# EAGLE board mic (EAGLE 6.1)
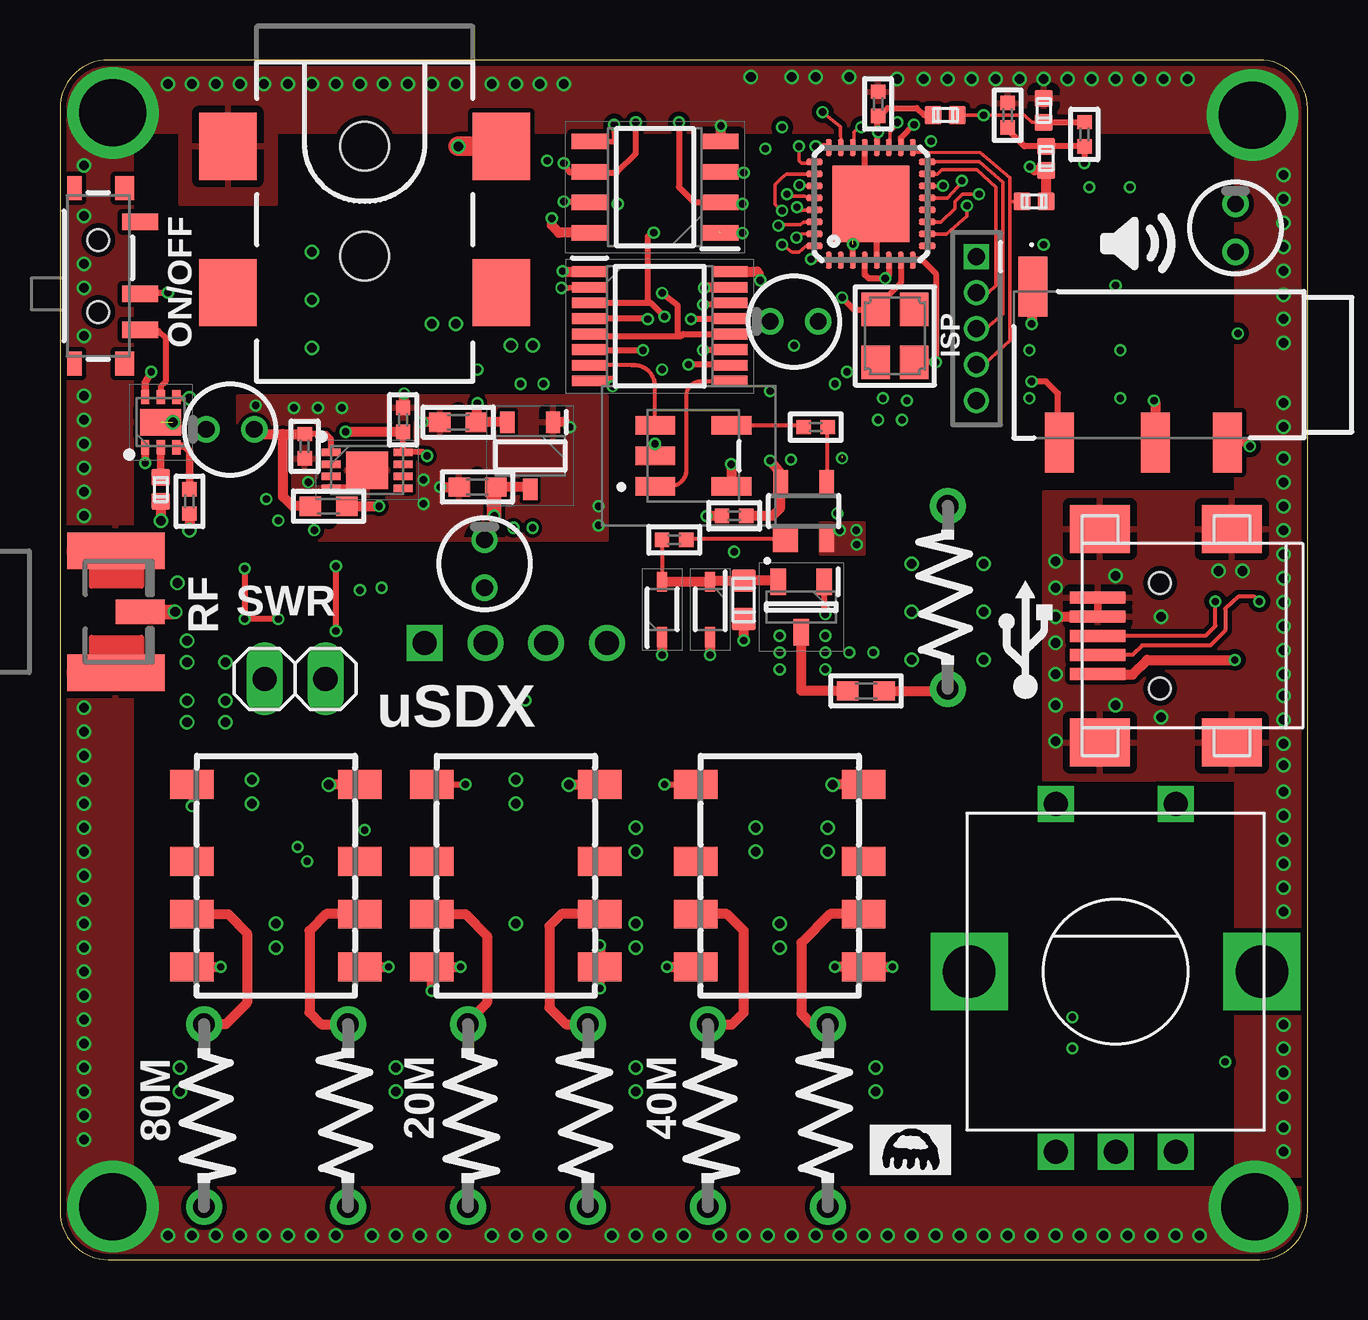
[diagram p3: board, top side]
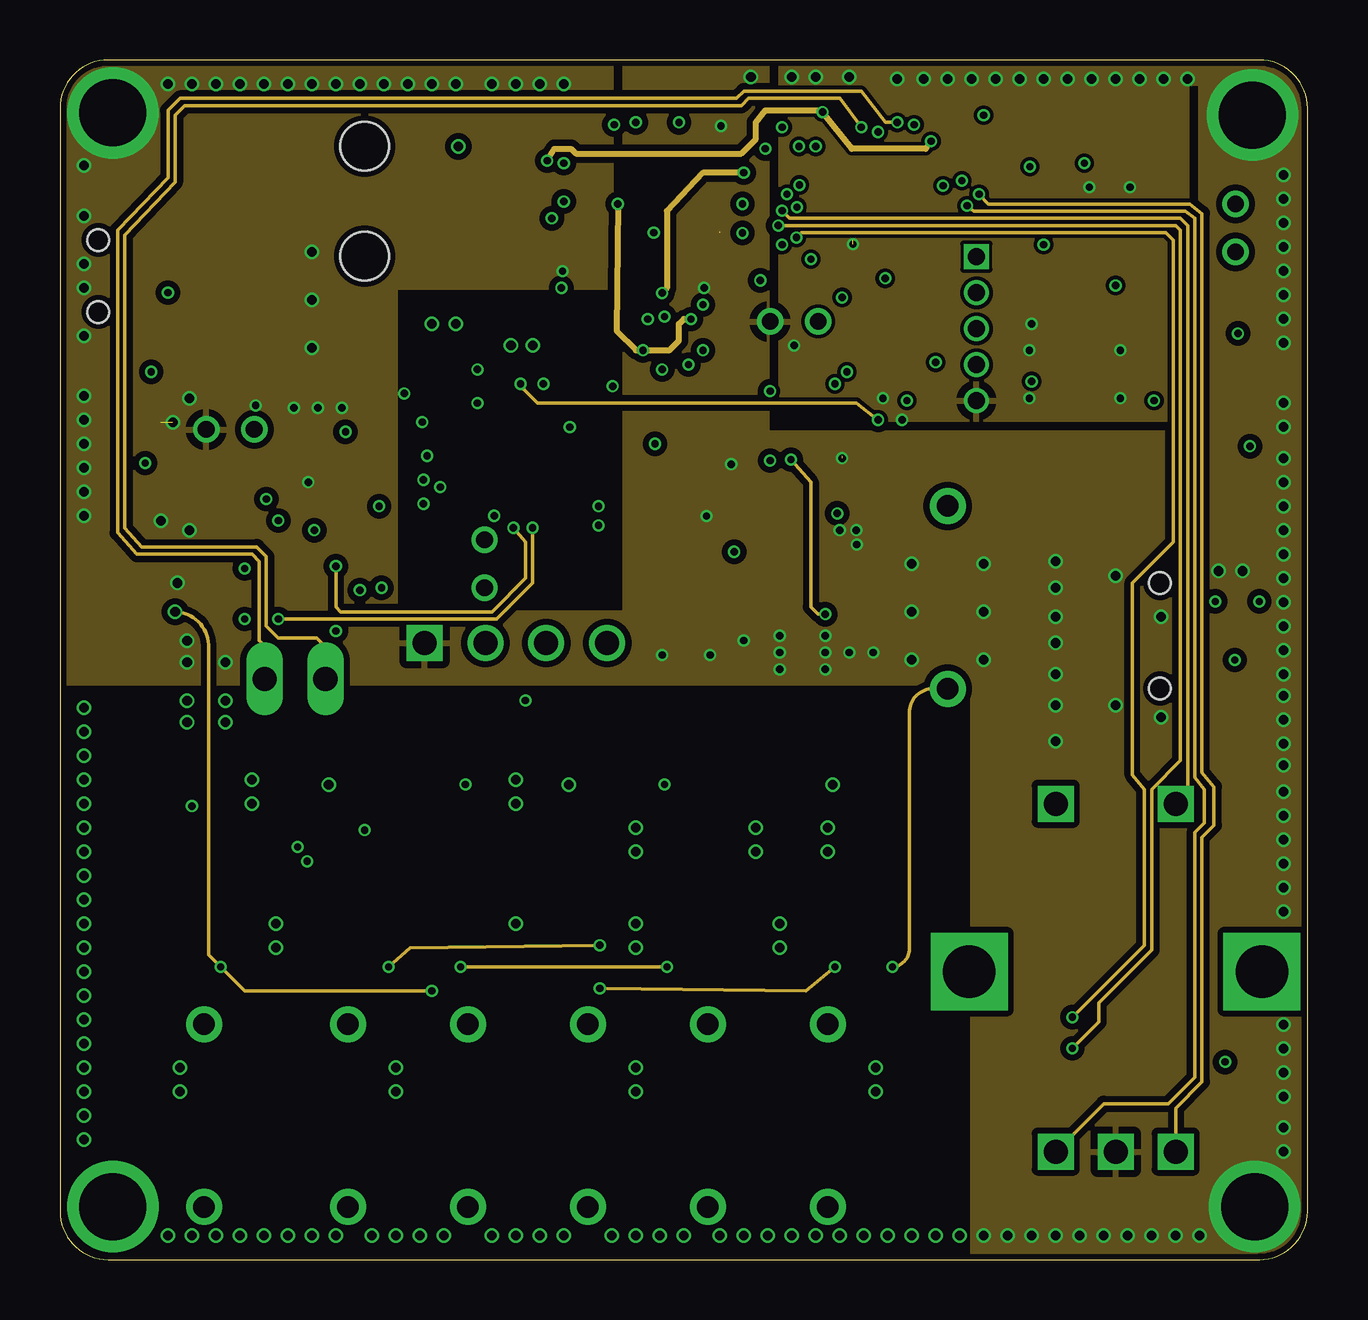
[diagram p4: board, inner layer Route2]
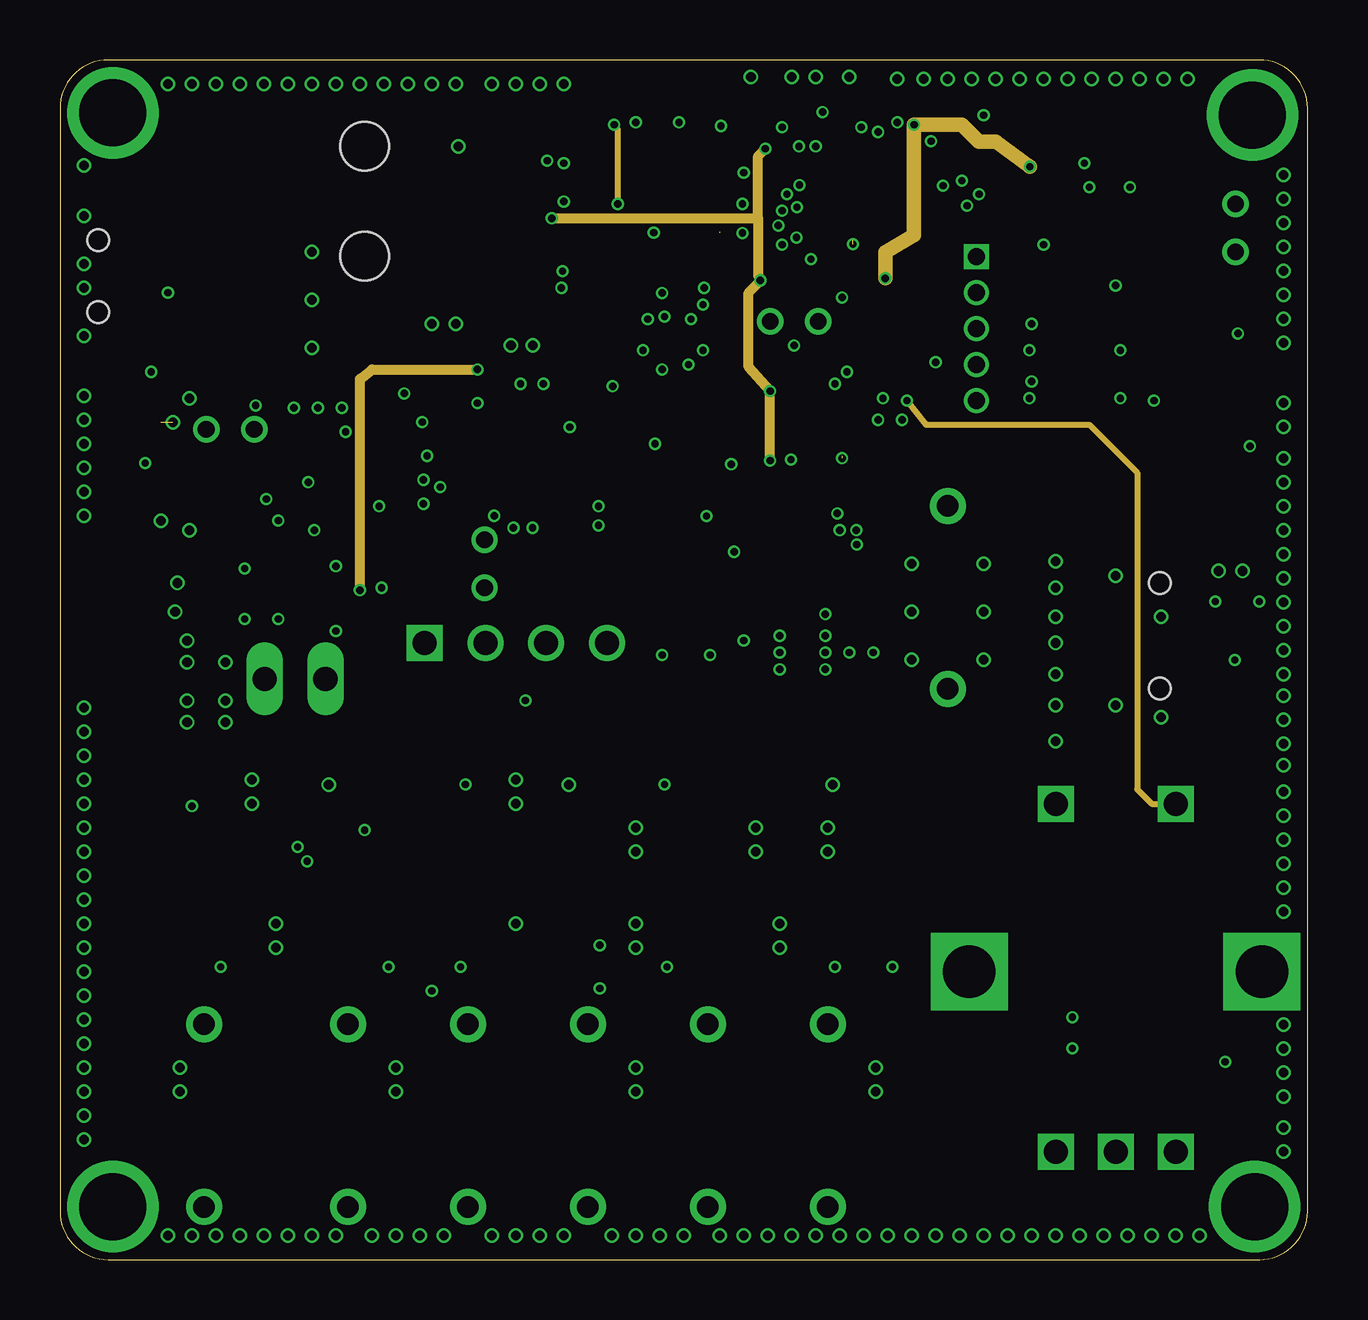
[diagram p5: board, inner layer Route3]
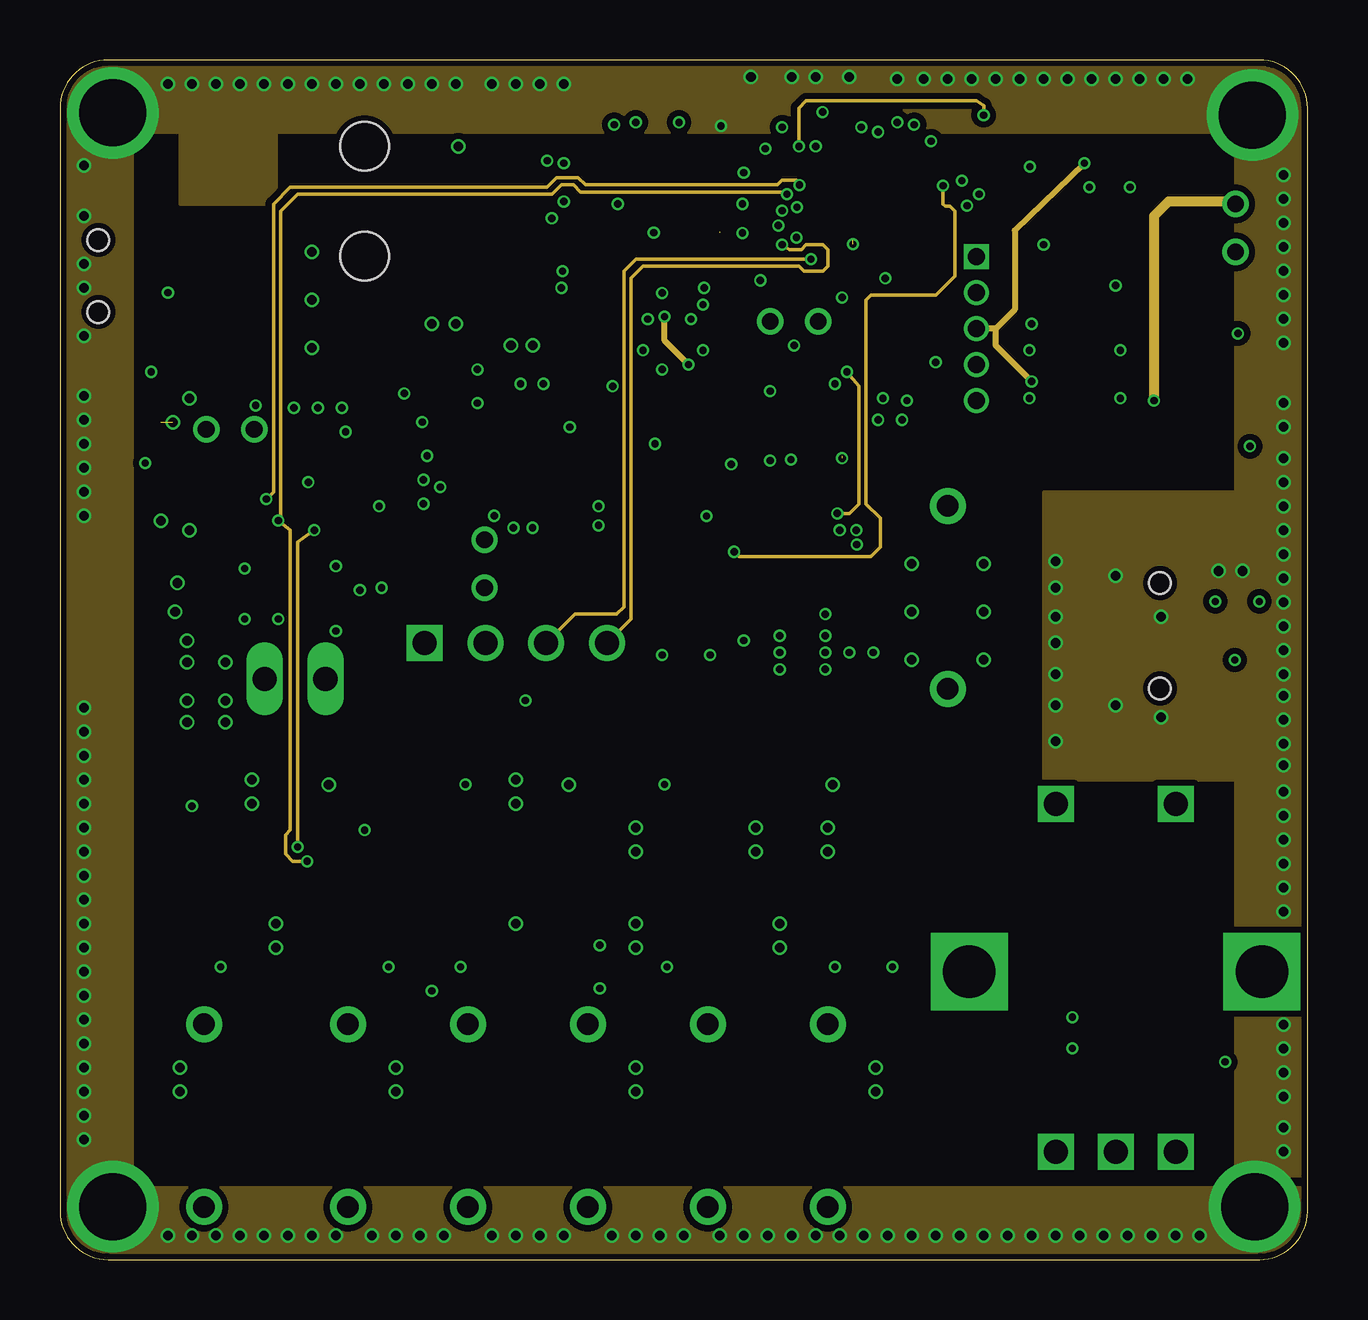
[diagram p6: board, inner layer Route14]
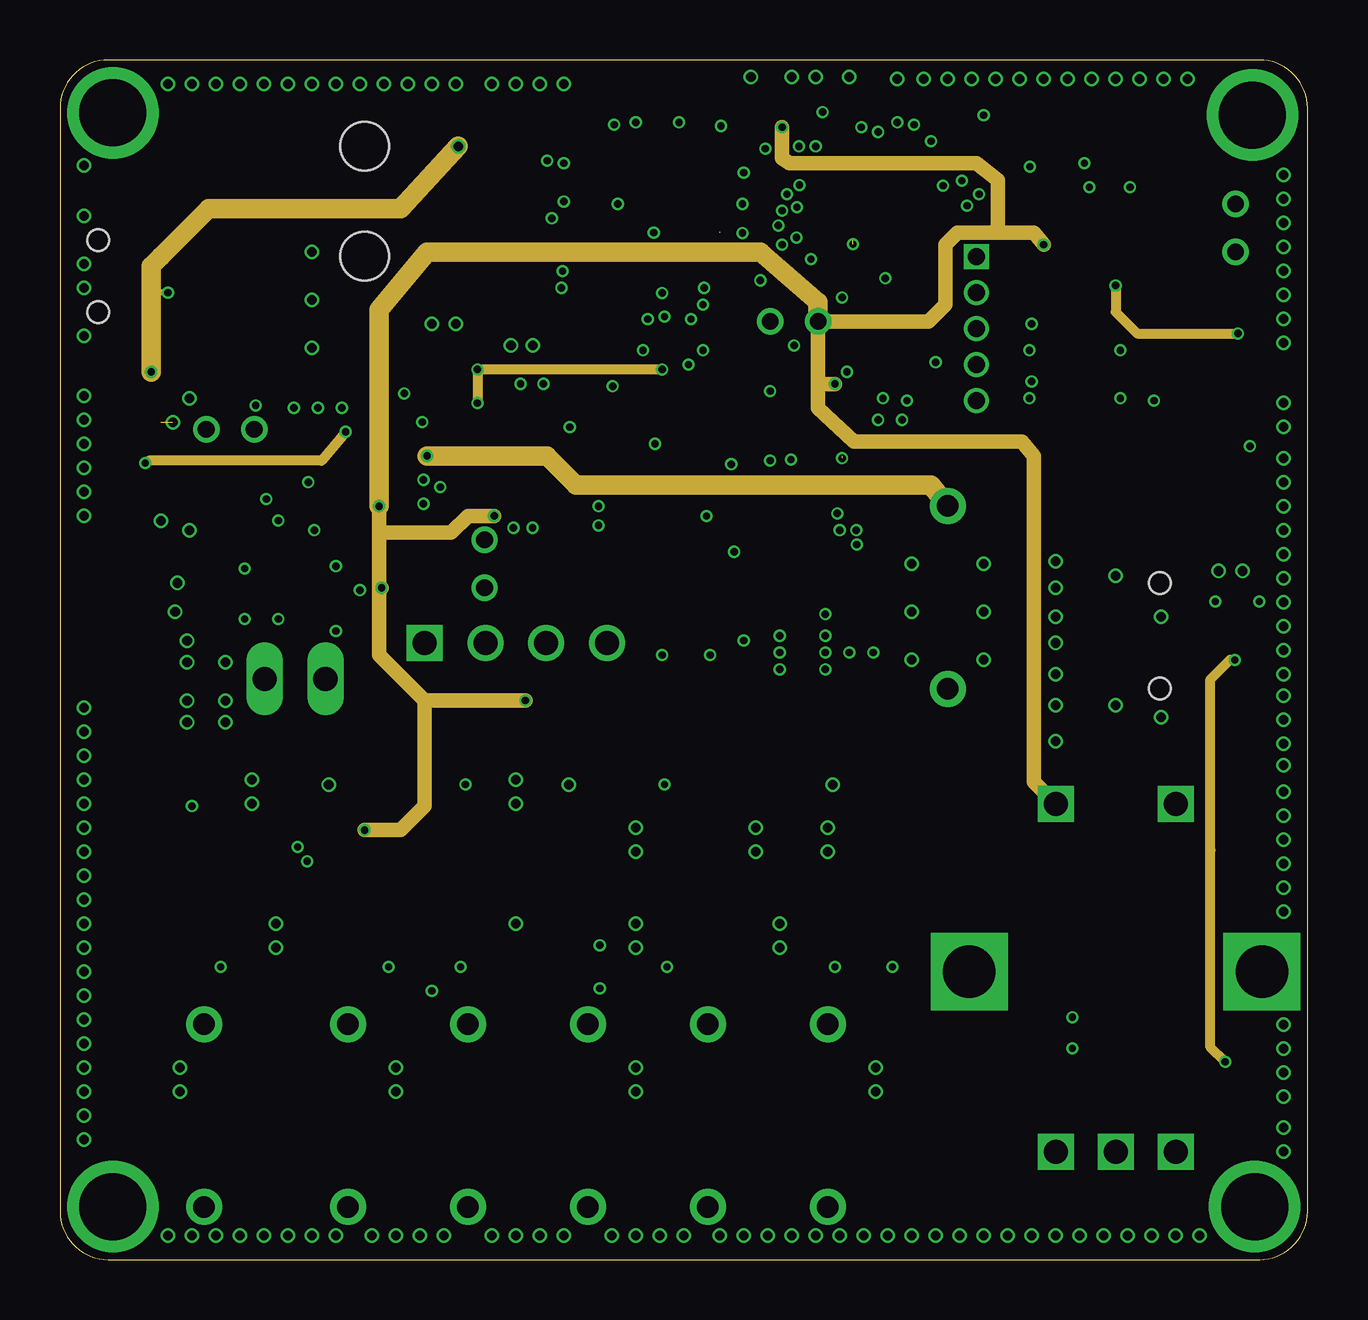
[diagram p7: board, inner layer Route15]
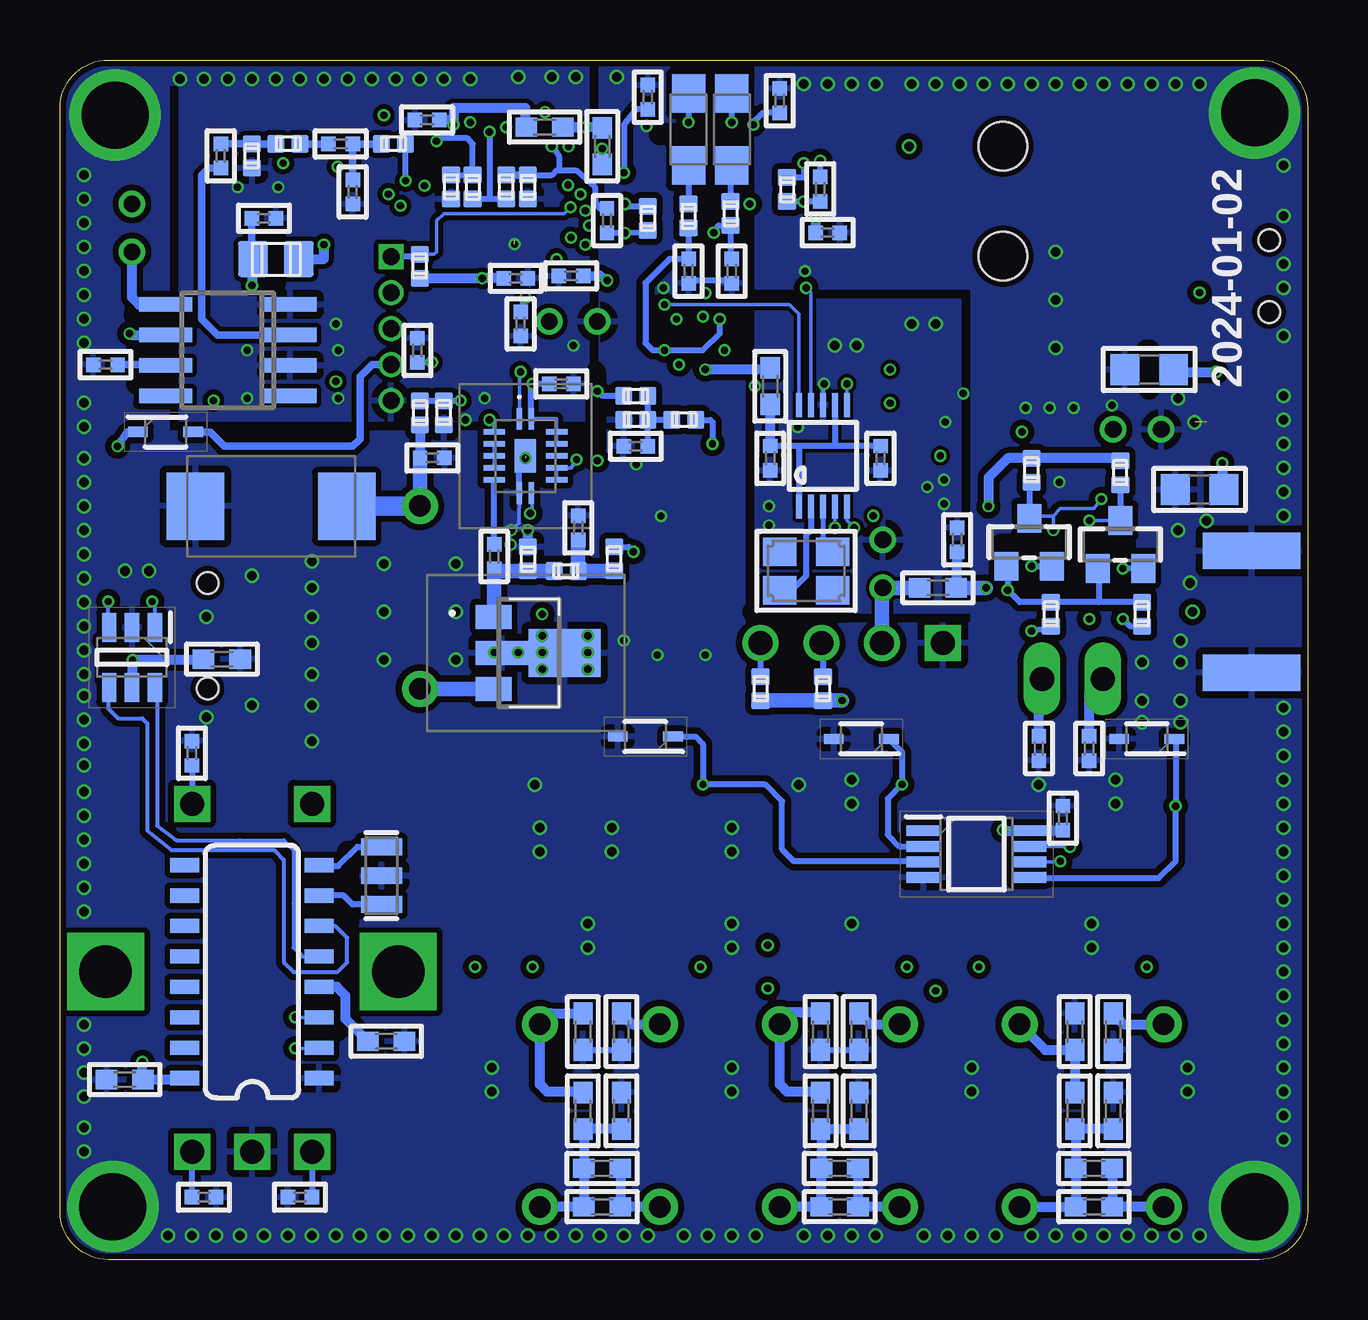
[diagram p8: board, bottom side, seen from below]

Size 52 x 50 mm. Coordinates in mm from the lower left corner, seen from the top.
Outline: 2,0 50,0 arc90 52,2 52,48 arc90 50,50 2,50 arc90 0,48 0,2 arc90 2,0
Copper layers (1*2*3*14*15*16): Top 0.035mm / dielectric 5mil / Route2 0.035mm / dielectric 0.5mm / Route3 0.035mm / dielectric 0.2mm / Route14 0.035mm / dielectric 0.5mm / Route15 0.035mm / dielectric 5mil / Bottom 0.035mm
Design rules: minimum track width 4.5mil, minimum drill 10mil, track to track 5mil, track to pad 5mil, pad to pad 5mil, via to via 5mil, smd to smd 1mil, copper to edge 10mil, drill to drill 8mil, minimum pad ring 6mil, minimum via ring 4mil, stop-mask expansion 4mil, vias tented up to drill 25mil, thermal gap 12mil
Net classes: 0 default: width 0.3 mm; 1 USB: width 0.406 mm
tRestrict: 4 lines
bRestrict: 25 lines

## Footprints (pad centres in the part's own frame; a part is rotated, then mirrored left to right if it is on the bottom)
_0402 = smd 0.6 x 0.6: 1 -0.508,0; 2 0.508,0
_0603 = smd 0.9 x 0.8: 1 -0.762,0; 2 0.762,0
SMC_A = smd 1.6 x 1.4: + -1.5,0; - 1.5,0
SANYO-OSCON_A = drill 0.7 pad 1.1: + 1,0; - -1,0
SMC_D = smd 2.4 x 2.8: + -3.15,0; - 3.15,0
_0805 = smd 1.2 x 1.3: 1 -1.016,0; 2 1.016,0
SODFL2512X90N = smd 0.82 x 0.42: 1 -1.15,0; 2 1.15,0
ALPS_EC12E_SW = drill 1 square: A -2.5,-7.5; B 2.5,-7.5; C 0,-7.5; D -2.5,7; E 2.5,7 | drill 2.2 square: GND1 -6.1,0; GND2 6.1,0
SOT95P280X130-3N = smd 0.9 x 0.6: 1 -1.4,0.95; 2 -1.4,-0.95; 3 1.4,0
SOIC127P600X175-8N = smd 1.528 x 0.65: 1 -2.711,1.905; 2 -2.711,0.635; 3 -2.711,-0.635; 4 -2.711,-1.905; 5 2.711,-1.905; 6 2.711,-0.635; 7 2.711,0.635; 8 2.711,1.905
SOP65P640X110-16N = smd 1.45 x 0.45: 1 -2.925,2.275; 2 -2.925,1.625; 3 -2.925,0.975; 4 -2.925,0.325; 5 -2.925,-0.325; 6 -2.925,-0.975; 7 -2.925,-1.625; 8 -2.925,-2.275; 9 2.925,-2.275; 10 2.925,-1.625; 11 2.925,-0.975; 12 2.925,-0.325; 13 2.925,0.325; 14 2.925,0.975; 15 2.925,1.625; 16 2.925,2.275
4-SOT143 = smd 1.1 x 1.05: 1 -1.15,0.76 | smd 1.1 x 0.6: 2 -1.15,-0.96; 3 1.15,-0.96; 4 1.15,0.96
SON50P300X200X100-9N = smd 0.8 x 0.3: 1 -1.5,0.75; 2 -1.5,0.25; 3 -1.5,-0.25; 4 -1.5,-0.75; 5 1.5,-0.75; 6 1.5,-0.25; 7 1.5,0.25; 8 1.5,0.75 | smd 1.75 x 1.55: 9 0,0
SON65P200X200X80-7N = smd 0.6 x 0.35: 1 -1.05,0.65; 2 -1.05,0; 3 -1.05,-0.65; 4 1.05,-0.65; 5 1.05,0; 6 1.05,0.65 | smd 1.1 x 1.7: 7 0,0
74HC00BQ115 = smd 0.9 x 0.24: 1 -1.55,-0.25; 7 1.55,-0.25; 8 1.55,0.25; 14 -1.55,0.25 | smd 0.24 x 0.9: 2 -1,-1.3; 3 -0.5,-1.3; 4 0,-1.3; 5 0.5,-1.3; 6 1,-1.3; 9 1,1.3; 10 0.5,1.3; 11 0,1.3; 12 -0.5,1.3; 13 -1,1.3 | smd 1.4 x 0.9: 15 0,0
MSOP10 = smd 0.25 x 1: 1 -1,-2.113; 2 -0.5,-2.113; 3 0,-2.113; 4 0.5,-2.113; 5 1,-2.113; 6 1,2.113; 7 0.5,2.113; 8 0,2.113; 9 -0.5,2.113; 10 -1,2.113
MLF32-TH = smd 0.7 x 0.25: 1 -2.35,1.75; 2 -2.35,1.25; 3 -2.35,0.75; 4 -2.35,0.25; 5 -2.35,-0.25; 6 -2.35,-0.75; 7 -2.35,-1.25; 8 -2.35,-1.75; 17 2.35,-1.75; 18 2.35,-1.25; 19 2.35,-0.75; 20 2.35,-0.25; 21 2.35,0.25; 22 2.35,0.75; 23 2.35,1.25; 24 2.35,1.75 | smd 0.25 x 0.7: 9 -1.75,-2.35; 10 -1.25,-2.35; 11 -0.75,-2.35; 12 -0.25,-2.35; 13 0.25,-2.35; 14 0.75,-2.35; 15 1.25,-2.35; 16 1.75,-2.35; 25 1.75,2.35; 26 1.25,2.35; 27 0.75,2.35; 28 0.25,2.35; 29 -0.25,2.35; 30 -0.75,2.35; 31 -1.25,2.35; 32 -1.75,2.35 | smd 3.2 x 3.2: TH 0,0
SO08 = smd 0.6 x 2.2: 1 -1.905,-2.6; 2 -0.635,-2.6; 3 0.635,-2.6; 4 1.905,-2.6; 5 1.905,2.6; 6 0.635,2.6; 7 -0.635,2.6; 8 -1.905,2.6
SOP65P490X110-8N = smd 1.425 x 0.45: 1 -2.212,0.975; 2 -2.212,0.325; 3 -2.212,-0.325; 4 -2.212,-0.975; 5 2.212,-0.975; 6 2.212,-0.325; 7 2.212,0.325; 8 2.212,0.975
SOT95P280X145-6N = smd 1.2 x 0.6: 1 -1.25,0.95; 2 -1.25,0; 3 -1.25,-0.95; 4 1.25,-0.95; 5 1.25,0; 6 1.25,0.95
SO016 = smd 0.6 x 1.2: 1 -4.445,-2.8; 2 -3.175,-2.8; 3 -1.905,-2.8; 4 -0.635,-2.8; 5 0.635,-2.8; 6 1.905,-2.8; 7 3.175,-2.8; 8 4.445,-2.8; 9 4.445,2.8; 10 3.175,2.8; 11 1.905,2.8; 12 0.635,2.8; 13 -0.635,2.8; 14 -1.905,2.8; 15 -3.175,2.8; 16 -4.445,2.8
SPARKFUN-CONNECTORS_PIC-ICSP-MINI = drill 0.7 square: 1 -3,0 | drill 0.7: 2 -1.5,0; 3 0,0; 4 1.5,0; 5 3,0
POWER_JACK_SMD = smd 2.8 x 2.4: GND 0,-5.7; P$4 6.1,-5.7; VIN0 0,5.7; VIN1 6.1,5.7 | hole 2.032: 0,0; 4.572,0
PRT12639 = smd 1.2 x 2.5: 1 6.25,-3.25; 2 5.15,3.25; 3 1.15,3.25; 4 -1.85,3.25
1X02 = drill 1.016 long: 1 -1.27,0; 2 1.27,0
G6KU-2F-Y = smd 1.2 x 1.8: 1 -3.8,-3.5; 2 -0.6,-3.5; 3 1.6,-3.5; 4 3.8,-3.5; 5 3.8,3.5; 6 1.6,3.5; 7 -0.6,3.5; 8 -3.8,3.5
RCL_TFI0305 = drill 0.9 pad 1.5: 1 -3.81,0; 2 3.81,0
NEW_DIY-MODULES_(1)_DISPLAY-OLED-128X64-I2C = drill 1 square: 1 -3.81,12.7 | drill 1: 2 -1.27,12.7; 3 1.27,12.7; 4 3.81,12.7
SWITCH_SPST_SMD_A = smd 0.7 x 1.5: 1 -2.25,-1.75; 2 -0.75,-1.75; 3 2.25,-1.75 | smd 1 x 0.6: GND1 -3.65,1; GND3 3.65,1 | smd 1 x 0.8: GND2 -3.65,-1.1; GND4 3.65,-1.1 | hole 0.9: -1.5,0; 1.5,0
SOT96P240X100-3N = smd 1.1 x 0.65: 1 -1.05,0.96; 2 -1.05,-0.96; 3 1.05,0
RQA0009SXAQS = smd 1 x 1.5: 1 -1.5,-1.475; 3 1.5,-1.475 | smd 1 x 2.2: 2 0,-1.125 | smd 2 x 3: 4 0,1.475
SOT23-WIDE = smd 1 x 1.2: 1 -0.95,-1; 2 0.95,-1; 3 0,1
C0402 = smd 0.75 x 0.7: 1 0,0.5; 2 0,-0.5
C0603 = smd 1 x 0.95: 1 0,0.8; 2 0,-0.8
C0805 = smd 1.5 x 1.25: 1 0,0.95; 2 0,-0.95
TC11T = smd 0.76 x 1.65: 1 -1.27,1.59; 2 0,1.59; 3 1.27,1.59; 4 1.27,-1.59; 6 -1.27,-1.59
MODULATOR_MICROBUILDER_SMA_EDGELAUNCH_UFL = smd 4.064 x 1.524: GND@1 2.032,-2.54; GND@2 2.032,2.54 | smd 4.064 x 1.524 bottom: GND@3 2.032,2.54; GND@4 2.032,-2.54 | smd 2.032 x 1.016: P 3.048,0
MINI-USB-B5 = smd 2.3 x 0.5: 1 8.55,6.6; 2 8.55,5.8; 3 8.55,5; 4 8.55,4.2; 5 8.55,3.4 | smd 2.5 x 2: M1 2.95,9.45; M2 8.45,9.45; M3 2.95,0.55; M4 8.45,0.55 | hole 0.9: 5.95,2.8; 5.95,7.2
CRYSTAL_3.2X2.5 = smd 1.4 x 1.2: 1 -1.1,-0.8; 2 1.1,0.8; GND1 -1.1,0.8; GND2 1.1,-0.8
RESONATOR-SMD = smd 0.7 x 1.7: 1 -1.2,0; 2 0,0; 3 1.2,0

## Placement (x,y rotation side)
C1  100n  [_0402]  29.2,43.3 90 bottom
C2  100n  [_0402]  30.7,41 180 bottom
C3  100n  [_0402]  34.1,48.17 270 top
C4  100n  [_0402]  28,33.9 180 bottom
C5  100n  [_0402]  20,42.8 0 bottom
C6  100n  [_0402]  28.1,31 180 top
C7  1uF  [_0603]  17.4,32.2 180 top
C8  1uF  [_0603]  16.6,34.9 180 top
C9  100n  [_0402]  27.5,48.45 90 bottom
C10  22uF  [SMC_A]  25.8,47.1 270 bottom
C11  100n  [_0402]  20.31,44.62 90 bottom
C12  10n  [_0402]  31.5,34.7 180 top
C13  10n  [_0402]  25.6,30 0 top
C14  220uF  [SANYO-OSCON_A]  7.1,34.6 0 top
C15  1n  [_0603]  33.6,23.7 180 top
C16  100n  [_0402]  24,41.2 90 bottom
C17  100n  [_0402]  25.8,41.2 90 bottom
C18  22uF  [SMC_A]  24,47.1 270 bottom
C19  10uF  [_0402]  10.2,33.9 270 top
C20  100n  [_0402]  22,48.3 270 bottom
C21  10uF  [_0402]  14.3,35 90 top
C22  100n  [_0402]  36.48,33.41 0 bottom
C23  100uF  [SMC_D]  43.2,31.4 180 bottom
C24  100n  [_0805]  4.5,32.1 180 bottom
C25  470n  [_0402]  17.8,33.4 270 bottom
C26  1n  [_0402]  5.4,31.6 270 top
C27  100n  [_0402]  30.4,30.5 270 bottom
C28  100n  [_0402]  31.1,36.5 0 bottom
C29  470n  [_0402]  22.4,33.4 270 bottom
C30  10n  [_0402]  33.9,29.3 90 bottom
C31  220uF  [SANYO-OSCON_A]  30.6,39.1 0 top
C32  100n  [_0402]  33,40.9 0 bottom
C33  1n  [_0402]  42,2.6 0 bottom
C34  1n  [_0402]  46,2.6 0 bottom
C35  10uF  [_0805]  6.6,37.1 180 bottom
C36  1n  [_0402]  46.5,21.1 270 bottom
C37  22p  [_0402]  32.8,39 270 bottom
C38  22p  [_0402]  37.1,37.9 90 bottom
C39  1n  [_0402]  11.2,21.3 90 bottom
C40  1n  [_0402]  9.1,21.3 90 bottom
C41  100n  [_0402]  42.7,46.9 90 top
C42  10n  [_0402]  39.5,47.7 270 top
C43  100n  [_0402]  43.5,43.4 180 bottom
C44  100n  [_0402]  36.7,47.5 180 bottom
C45  470n  [_0402]  40.3,46.5 180 bottom
C46  470n  [_0402]  45.3,46 270 bottom
C47  220uF  [SANYO-OSCON_A]  17.7,29 270 top
C48  10n  [_0402]  39.8,44.5 90 bottom
C49  220uF  [SANYO-OSCON_A]  49,43 270 top
C50  10uF  [_0402]  14.6,30 270 bottom
C51  1uF  [_0402]  50.1,37.3 0 bottom
C52  680  [_0603]  8.1,9.5 90 bottom
C53  300  [_0603]  28.6,9.5 90 bottom
C54  130  [_0603]  18.7,9.5 90 bottom
C55  1n  [_0603]  8.9,2.2 0 bottom
C56  100n  [_0402]  10.2,18.4 270 bottom
C57  1n  [_0603]  8.9,3.8 180 bottom
C58  470  [_0603]  29.4,2.2 180 bottom
C59  470  [_0603]  29.4,3.8 180 bottom
C60  [_0603]  19.5,3.8 180 bottom
C61  470  [_0603]  19.5,2.2 180 bottom
C62  1800  [_0603]  8.1,6.2 270 bottom
C63  1000  [_0603]  28.6,6.2 270 bottom
C64  470  [_0603]  18.7,6.2 270 bottom
C65  620  [_0603]  9.7,6.2 270 bottom
C66  300  [_0603]  30.2,6.2 270 bottom
C67  150  [_0603]  20.3,6.2 270 bottom
C68  1800  [_0603]  9.7,9.5 270 bottom
C69  1000  [_0603]  30.2,9.5 90 bottom
C70  470  [_0603]  20.3,9.5 90 bottom
C71  1uF  [_0603]  49.3,7.5 0 bottom
C72  1uF  [_0603]  45.25,25.02 0 bottom
C73  10n  [_0603]  38.4,9.1 180 bottom
D1  1N4148WS  [SODFL2512X90N]  27.1,27.1 270 top
D2  1N4148WS  [SODFL2512X90N]  25.1,27.1 90 top
D3  1N4148WS  [SODFL2512X90N]  47.6,34.5 0 bottom
D4  1N4148WS  [SODFL2512X90N]  27.6,21.8 180 bottom
D5  1N4148WS  [SODFL2512X90N]  18.6,21.7 180 bottom
D6  1N4148WS  [SODFL2512X90N]  6.7,21.7 180 bottom
ENCODER1  EC12E_SW  [ALPS_EC12E_SW]  44,12 0 top
FB1  FERITTE  [_0603]  29.4,46.4 90 bottom
FB2  FERITTE  [_0603]  11.2,31.4 0 top
FB3  FERITTE  [_0603]  22.4,36.4 90 bottom
FB4  FERITTE  [_0603]  31.8,47.2 0 bottom
FB5  FERITTE  [_0603]  15.4,28 0 bottom
IC1  XC6206P332MR  [SOT95P280X130-3N]  19.6,33.5 270 top
IC2  NE5532DR  [SOIC127P600X175-8N]  24.8,44.7 180 top
IC3  FST3253MTCX  [SOP65P640X110-16N]  25,38.9 0 top
IC4  MAX2650EUS+T  [4-SOT143]  31,31.2 90 top
IC5  MCP1703T-5002E_MC  [SON50P300X200X100-9N]  12.8,32.9 0 top
IC6  TPS22810DRVT  [SON65P200X200X80-7N]  4.2,34.9 90 top
IC7  74HC00BQ,115  [74HC00BQ115]  32.6,33.5 270 bottom
IC8  Si5351A-B-GT  [MSOP10]  20.2,33.5 0 bottom
IC9  ATmega328P  [MLF32-TH]  33.8,44 90 top
IC10  LM386M-1  [SO08]  45,37.9 90 bottom
IC11  PCA9536DP,118  [SOP65P490X110-8N]  13.8,16.9 0 bottom
IC12  USBLC6-2SC6  [SOT95P280X145-6N]  49,25.1 270 bottom
IC13  CH340G  [SO016]  44,12 90 bottom
J1  Progm  [SPARKFUN-CONNECTORS_PIC-ICSP-MINI]  38.2,38.8 270 top
J2  POWER_JACKSMD  [POWER_JACK_SMD]  12.7,46.4 270 top
J3  PRT-12639  [PRT12639]  46.8,37.3 180 top
JP1  [1X02]  9.8,24.2 0 top
K1  G6KU-2F-Y  [G6KU-2F-Y]  9,16 270 top
K2  G6KU-2F-Y  [G6KU-2F-Y]  30,16 270 top
K3  G6KU-2F-Y  [G6KU-2F-Y]  19,16 270 top
L1  [RCL_TFI0305]  37,27.6 90 top
L2  [RCL_TFI0305]  6,6 270 top
L3  [RCL_TFI0305]  27,6 270 top
L4  [RCL_TFI0305]  17,6 270 top
L5  [RCL_TFI0305]  12,6 90 top
L6  [RCL_TFI0305]  32,6 90 top
L7  [RCL_TFI0305]  22,6 90 top
OLED  DISPLAY-OLED-128X64-I2C  [NEW_DIY-MODULES_(1)_DISPLAY-OLED-128X64-I2C]  19,13 0 top
ON/OF  [SWITCH_SPST_SMD_A]  1.6,41 90 top
Q1  BS170FTA  [SOT96P240X100-3N]  30.9,27.2 270 top
Q2  RQA0009SXAQS  [RQA0009SXAQS]  32.45,25.29 270 bottom
Q3  BSS138  [SOT23-WIDE]  11.6,29.9 0 bottom
Q4  BSS138  [SOT23-WIDE]  7.8,29.8 0 bottom
R1  10k  [C0402]  32.5,44.7 0 bottom
R2  10k  [C0402]  33.4,44.7 180 bottom
R3  1k  [C0402]  26,35 270 bottom
R4  10k  [C0402]  28,36 90 bottom
R5  10k  [C0402]  28,35 270 bottom
R6  82k  [C0402]  27.5,43.4 0 bottom
R7  10k  [C0402]  34.8,44.7 0 bottom
R8  10k  [C0402]  35.7,44.7 180 bottom
R9  82k  [C0402]  21.7,44.6 0 bottom
R10  100  [C0402]  25.8,43.5 0 bottom
R11  100  [C0402]  24.05,43.6 0 bottom
R12  100  [C0603]  28.5,27.5 180 top
R13  470  [C0402]  4.2,32.1 0 top
R14  100k  [C0402]  32.5,29.2 0 bottom
R15  10k  [C0402]  10.7,26.9 180 bottom
R16  10k  [C0402]  6.9,26.9 180 bottom
R17  10k  [C0402]  11.5,32.9 180 bottom
R18  10k  [C0402]  7.8,32.8 180 bottom
R19  10k  [C0402]  28.9,29.2 180 bottom
R20  10k  [C0402]  30.9,28.7 90 bottom
R21  10k  [C0402]  37,41.4 180 bottom
R22  10k  [C0402]  36,35.3 180 bottom
R23  1M  [C0402]  37,35.3 0 bottom
R24  1k  [C0402]  40.6,44.1 270 top
R25  4.7k  [C0402]  22.8,23.8 0 bottom
R26  10k  [C0402]  41.1,45.9 0 top
R27  10k  [C0402]  36.9,47.7 270 top
R28  33  [C0805]  43,41.7 90 bottom
R29  4.7k  [C0402]  20.2,23.8 0 bottom
R30  10k  [C0402]  41,47.9 0 top
R31  10k  [C0402]  38.1,46.5 270 bottom
R32  10k  [C0402]  42.5,46.5 270 bottom
R33  1k  [C0402]  44,46 180 bottom
T1  TC1-1T+  [TC11T]  26.4,33.5 90 top
TX  [MODULATOR_MICROBUILDER_SMA_EDGELAUNCH_UFL]  0.3,27 0 top
USB  MINI-USB  [MINI-USB-B5]  51.8,31 180 top
Y1  25MHz  [CRYSTAL_3.2X2.5]  20.9,28.7 180 bottom
Y2  20MHz  [CRYSTAL_3.2X2.5]  34.8,38.5 90 top
Y3  12MHz  [RESONATOR-SMD]  38.6,16 270 bottom

## Tracks (layer width: path | path; a pad name or v marks a point on that pad's centre or on a via)
5V  (via drill 0.3)
  Top 0.406: FB2.2 v13.3,31.4 | IC1.3 19.5,32.2 C7.1
  Top 0.61: C7.1 18.1,32.14 v18.1,31
  Route15 0.61: ENCODER1.D 40.6,19.9 40.6,33.5 40.1,34.1 33.1,34.1 31.6,35.5 C28.1 | C28.1 C31.+ 36.2,39.1 36.9,39.8 36.9,42.3 37.4,42.8 39.1,42.8 | v41,42.3 40.6,42.8 39.1,42.8 | v32.3,36.5 C28.1 | v19.4,23.3 15.2,23.3 | 15.2,23.3 13.3,25.2 13.3,28 | 13.3,28 13.3,30.3 | 13.3,30.3 v13.3,31.4 | v13.4,28 13.3,28 | v30.1,47.2 30.1,45.9 30.4,45.7 38.2,45.7 39.1,45 39.1,42.8 | v18.1,31 17,31 16.3,30.3 13.3,30.3 | 15.2,23.3 15.2,18.9 14.2,17.9 v12.7,17.9
  Route15 0.813: v13.3,31.4 13.3,39.6 15.3,42 29.2,42 31.6,39.9 C31.+
  Bottom 0.152: IC7.12 IC7.13 31.3,35.05 IC7.14 32.37,35.1
  Bottom 0.254: 32.37,35.1 32.37,36.43 v32.3,36.5 C28.1
  Bottom 0.406: C56.2 10.22,17.88 IC11.8 12.68,17.88 v12.7,17.9 | R28.2 41,41.7 v41,42.3 | C50.2 14.64,28.95 FB5.2 | v30.1,47.2 FB4.2 29.44,47.2 FB1.2 | R18.2 7.9,33.4 R17.2 12.5,33.4 13.3,32.6 v13.3,31.4
  Bottom 0.61: R25.2 R29.2 v19.4,23.3 | FB5.2 v13.4,28
A  (via drill 0.3)
  Top 0.152: IC9.11 36.21,43.24 36.71,43.24 37.3,43.8 37.3,44.1 37.61,44.41 v38.31,44.41
  Route2 0.152: ENCODER1.B 46.5,6.31 47.6,7.41 47.6,17.6 48.1,18.1 48.1,19.7 47.6,20.3 47.6,43.6 47.1,44 38.7,44 v38.31,44.41
  Bottom 0.254: ENCODER1.B C34.1
ANT  (via drill 0.3, 0.4)
  Top 0.406: K1.4 v6.7,12.2 | v15.5,11.2 K3.4 v16.7,12.2 | v25.3,12.2 K2.4
  Top 0.61: TX.P v4.8,27
  Route2 0.139: v15.5,11.2 7.7,11.2 v6.7,12.2 6.2,12.7 6.2,25.5 arc90 v4.8,27 | v16.7,12.2 v25.3,12.2
AREF  (via drill 0.3)
  Top 0.254: 34.05,46.93 34.05,47.44 C3.2 34.51,48 35.7,48 36,47.7 R27.2 | 34.05,46.93 IC9.20 | v34.1,47 34.05,46.93
  Bottom 0.254: R2.1 34.1,44.2 | 34.1,44.2 R7.2 | v34.1,47 34.1,44.2
B  (via drill 0.3)
  Top 0.152: v37.81,43.93 37.8,43.5 36.95,42.75 IC9.10
  Route2 0.152: ENCODER1.A 43.5,6.5 46.2,6.5 47.3,7.6 47.3,17.8 47.7,18.2 47.7,19.6 47.3,20.1 47.3,43.4 46.9,43.7 38.1,43.7 v37.81,43.93
  Bottom 0.254: ENCODER1.A C33.2
CLK0  (via drill 0.3)
  Top 0.152: IC3.14 27.85,39.8
  Top 0.254: 27.85,39.8 v26.8,39.8
  Bottom 0.152: v26.8,39.8 21.6,39.8 21.2,39.4 IC8.10
CLK1  (via drill 0.3)
  Top 0.152: 21.52,40.52 IC3.2
  Top 0.254: v20.9,40.5 21.52,40.52
  Bottom 0.152: IC8.9 20.7,40.3 v20.9,40.5
CLK2  (via drill 0.3)
  Route2 0.152: v34.1,35 33.2,35.7 19.9,35.7 19.2,36.4 v19.2,36.5
  Bottom 0.152: IC7.2 33.9,34.8 v34.1,35 | IC8.6 v19.2,36.5
EN1
  Top 0.254: ON/OF.1 3.4,38.7 4.1,38.7 4.4,38.4 4.4,36.6 4.2,36.4 IC6.5
GND  (via drill 0.3, 0.4, 2.8)  (3 unrouted)
  Top 0.254: IC9.3 33.05,42.48 33.1,42.7 | 33.1,42.7 33.8,43.4 IC9.TH 33.8,44.8 33.54,44.99 33.54,46.29 IC9.21 | IC9.5 34.05,42.8 33.1,42.8 33.1,42.7 | IC6.4 4.9,35.9 v5.4,35.9
  Top 0.305: USB.5 USB.4 | IC5.9 12.05,32.15 IC5.4
  Top 0.406: K2.8 v32.2,19.8 | v21.2,19.8 K3.8 | K1.8 v11.2,19.8 | v41.5,26.8 USB.4 | v28.5,25.8 R12.1 | D1.2 v27.1,25.2 | D2.1 v25.1,25.2 | v27.98,33.15 27.98,32.43 T1.6 | C6.2 v26.95,30.99 | v21.25,34.7 21.05,34.9 IC1.1 | v26.85,40.5 26.88,40.52 IC3.15 | v20.95,41.2 21.18,41.17 IC3.1 | v23.04,36.4 23.04,36.62 IC3.8 | IC2.4 27.55,46.64 v27.55,47.25 | J3.1 40.5,40.5 v40.5,39 | C8.2 15.85,34.91 v15.1,34.91 | v15.85,32.2 16.64,32.19 C7.2 | C21.2 14.35,35.56 v14.35,36.1 | R13.2 v4.2,30.8 | C26.2 v5.4,30.4
  Bottom 0.152: 32.86,32 IC7.7 32.86,30.7 v33.19,30.4 | 32.86,33.4 v32.6,33.4
  Bottom 0.157: v20.15,36.5 20.2,36.45 IC8.8
  Bottom 0.254: 32.86,32 32.86,33.4 | C16.1 24.2,40.7 24.3,40.8 25.5,40.8 25.61,40.69 C17.1 | C70.1 C54.1 | C69.1 C53.1
  Bottom 0.406: R14.1 v32.5,30.4 | v30,26 v30,25.3 v30,24.6 | v31.9,26 v31.9,25.3 v31.9,24.6
  other vias: 2.2,47.8 49.7,47.7 49.8,2.2 2.2,2.2 33.21,29.8 51,21.5 51,30.4 41.5,29.1 41.5,21.6 51,5.5 51,9.8 4.5,1 5.5,1 6.5,1 7.5,1 8.5,1 9.5,1 10.5,1 11.5,1 13,1 14,1 15,1 16,1 18,1 19,1 20,1 21,1 23,1 24,1 25,1 26,1 27.5,1 28.5,1 29.5,1 30.5,1 31.5,1 32.5,1 33.5,1 34.5,1 35.5,1 36.5,1 37.5,1 38.5,1 39.5,1 40.5,1 41.5,1 42.5,1 43.5,1 44.5,1 45.5,1 46.5,1 47.5,1 35.1,35 22.45,31.4 33.05,42.32 42.9,44.7 4.7,34.9 10.35,32.4 1,5 1,6 1,7 1,8 1,9 1,10 1,11 1,12 1,13 1,14 1,15 1,16 1,17 1,18 1,19 1,20 1,21 1,22 1,23 1,31 1,32 1,33 1,34 1,35 1,36 1,38.5 1,40.5 1,41.5 1,43.5 1,45.6 4.5,49 5.5,49 6.5,49 7.5,49 8.5,49 9.5,49 10.5,49 11.5,49 12.5,49 13.5,49 14.5,49 15.5,49 16.5,49 18,49 19,49 20,49 21,49 28.8,49.3 30.5,49.3 31.5,49.3 32.9,49.3 36,49.2 34.9,49.2 37,49.2 38,49.2 39,49.2 40,49.2 41,49.2 42,49.2 43,49.2 44,49.2 45,49.2 46,49.2 47,49.2 51,45.2 51,44.2 51,20.6 51,19.5 51,18.5 51,17.5 51,16.5 51,15.5 51,14.5 51,8.8 51,7.8 51,6.8 51,4.5 51,22.5 51,23.5 51,31.4 51,32.4 51,33.4 51,43.2 51,42.2 51,41.2 51,40.2 51,39.2 51,38.2 51,34.7 51,35.7 41.5,24.4 22.45,30.6 15.15,32.5 15.15,31.5 9.75,35.5 11.75,35.5 10.75,35.5 8.15,35.6 10.5,42 10.5,38 15.5,39 10.5,40 16.5,39 38.5,29 38.5,27 38.5,25 35.5,29 35.5,27 35.5,25 51,29.4 51,28.4 51,27.4 51,26.4 51,25.4 51,24.4 44.6,44.7 40.4,37.9 40.4,35.9 44.2,37.9 44.2,35.9 34.3,35.9 30.6,38.1 18.8,38.1 19.7,38.1 24,18 24,13 24,17 24,14 29,18 29,17 32,18 32,17 19,20 19,19 8,20 8,19 9,14 9,13 19,14 30,14 30,13 14,8 14,7 24,8 24,7 34,8 34,7 5,8 5,7 33.9,25.3 32.9,25.3 48.3,28.7 49.3,28.7 45.9,26.8 45.9,22.6 41.5,23.1 41.5,25.7 41.5,28 44,23.1 44,28.5 5.3,25.8 5.3,24.9 5.3,23.3 5.3,22.4 6.9,24.9 6.9,23.3 6.9,22.4 4.9,28.2
  pour Bottom (isolate 0.254): 52,0 0,0 0,50 23,50 23,40.5 14,40.5 14,26.5 23.5,26.5 23.5,50 29.5,50 29.5,34.5 47.5,34.5 47.5,50 52,50
  pour Top (isolate 0.2, rank 3): 52,3 3,3 3,47 5,47 5,44 9,44 9,47 49,47 49,32 41,32 41,20 49,20 49,3.5 52,3.5 52,50 0,50 0,0 52,0
  pour Top (no thermals): 33.5,29.4 31.7,29.4 31.7,30.7 33.5,30.7
  pour Top (isolate 0.15): 22.8,36 7.4,36 7.4,30 22.8,30
  pour Route14 (isolate 0.254, rank 3): 52,3 3,3 3,47 5,47 5,44 9,44 9,47 49,47 49,32 41,32 41,20 49,20 49,3.5 52,3.5 52,50 0,50 0,0 52,0
  pour Bottom (isolate 0.15): 23,27 14,27 14,28.5 14.5,28.5 14.5,40 23,40
  pour Bottom (isolate 0.2): 30,50 30,35 47,35 47,49 47.5,49 47.5,50
  pour Route2 (isolate 0.254): 52,50 52,0 38,0 38,24 0,24 0,50 23,50 23,40.5 14,40.5 14,27 23.5,27 23.5,50 29.5,50 29.5,34.5 47.5,34.5 47.5,50
  pour Route2 (isolate 0.15): 30,50 30,35 47,35 47,49 47.5,49 47.5,50
I  (via drill 0.3)
  Top 0.152: v31.79,47.83 32.54,47.22 IC9.23
  Route2 0.254: v36.31,46.61 36.3,46.69 36.09,46.3 33,46.3 v31.79,47.83 31.74,47.9 29.4,47.9 29,47.4 29,46.7 28.4,46.1 21.5,46.1 21.3,46.3 20.61,46.3 v20.31,45.8
  Bottom 0.254: C11.2 v20.31,45.8 | v36.31,46.61 36.2,46.73 35.02,46.73 34.8,46.5 R7.1 R8.2
MISO  (via drill 0.3)
  Top 0.152: IC9.16 36.13,45.76 38.33,45.76 39.3,44.9 39.3,39.4 38.6,38.8 J1.3
  Top 0.254: C42.2 39.5,47.1 40.2,46.4 R26.1 C41.1 v42.7,45.7 | J3.2 41.6,34.1 41.6,36.1 41.1,36.6 v40.5,36.6
  Route14 0.254: v42.7,45.7 39.8,42.9 39.8,39.6 39,38.8 | 39,38.8 J1.3 | v40.5,36.6 39,38.1 39,38.8
MOSI
  Top 0.152: 36.21,45.24 IC9.15 36.57,45.25 36.75,45.43 38.21,45.43 39,44.7 39,40.6 38.7,40.3 J1.2
N$1
  Bottom 0.152: IC7.4 IC7.5 IC7.3
N$2
  Bottom 0.256: L2.2
  Bottom 0.406: C57.1 C55.2 L2.2
N$3
  Bottom 0.256: C65.2 9.66,5.4 | L5.1
  Bottom 0.406: 9.66,5.4 C57.2 C55.1 L5.1 | C62.2 C65.2
N$4
  Bottom 0.256: L3.2
  Bottom 0.406: L3.2 C58.1 C59.1
N$5
  Top 0.406: K1.3 7,14.4 7.8,13.6 7.8,10.7 6.91,9.81 L2.1
  Bottom 0.406: C52.2 7.65,9.81 L2.1
N$6
  Top 0.157: T1.3 arc-90 T1.3 24.8,36.5 arc90 23.82,37.27 IC3.7
N$7
  Top 0.256: L3.1
  Top 0.406: L3.1 28,9.8 28.5,10.3 28.5,13.7 27.8,14.4 K2.3
  Bottom 0.406: C53.2 28.15,9.81 L3.1
N$8
  Top 0.256: 17,9.9 L4.1
  Top 0.406: K3.3 16.9,14.4 17.8,13.5 17.8,10.7 17,9.9
  Bottom 0.406: C54.2 18.25,9.81 L4.1
N$9
  Top 0.406: K3.6 20.9,14.4 20.4,13.9 20.4,10.5 21.09,9.81 L7.2
  Bottom 0.256: C67.1 20.34,7 | C70.2 20.34,10.3
  Bottom 0.406: 20.34,7 21.7,7 22,7.3 L7.2 22,10.1 21.8,10.3 21.1,10.3 20.34,10.3
N$10
  Top 0.406: K2.6 32.1,14.4 30.9,13.2 30.9,10.26 31.35,9.81 L6.2
  Bottom 0.256: C66.1 30.24,7
  Bottom 0.406: C69.2 31.55,10.26 L6.2 32,7.3 31.7,7 30.24,7
N$11
  Top 0.406: K1.6 11.1,14.4 10.4,13.7 10.4,10.3 10.89,9.81 L5.2
  Bottom 0.406: L5.2 10.93,8.74 C68.2 C65.1
N$12
  Bottom 0.61: OLED.2 17.73,27.97 C47.+ FB5.1
N$13  (via drill 0.3)
  Top 0.152: IC9.7 35.05,41.69
  Top 0.254: v32.6,40.1 33.1,39.6 Y2.2 34,39.7 35.05,40.72 IC9.7
  Bottom 0.254: C37.1 32.7,39.51 32.7,39.5 32.7,40 v32.6,40.1
N$14  (via drill 0.3)
  Top 0.254: Y2.1 v36.5,37.4 36.5,41.1 35.9,41.7 35.6,41.7 IC9.8
  Bottom 0.254: C38.1 v36.5,37.4
N$15
  Bottom 0.256: C66.2 30.16,5.4 | C58.2 30.17,2.19
  Bottom 0.406: C63.2 C66.2 | 30.16,5.4 C59.2 C58.2 | 30.17,2.19 L6.1
N$16
  Top 0.157: IC3.9 arc-90 27.9,36.6 26.7,36.6 arc90 26.1,36 26.1,32.9 arc-90 25.43,32.23 T1.1
N$17
  Bottom 0.256: C61.2 20.27,2.19 | C67.2 20.26,5.4
  Bottom 0.406: C61.2 C60.2 20.26,5.4 | 20.27,2.19 L7.1 | C67.2 C64.2
N$18
  Bottom 0.256: L4.2
  Bottom 0.406: L4.2 C61.1 C60.1
N$19  (via drill 0.3)
  Top 0.256: v5.5,18.9 K1.1
  Bottom 0.256: IC11.5 11.56,15.9 7.3,15.9 6.2,15.9 5.5,16.6 v5.5,18.9 5.5,21.65 D6.1
N$20  (via drill 0.3)
  Top 0.256: v25.2,19.8 K2.1
  Bottom 0.254: D4.1 25.5,21.8 25.2,21.5 v25.2,19.8
  Bottom 0.256: IC11.3 16.04,16.6 21.4,16.6 21.9,17.1 21.9,19.1 22.6,19.8 v25.2,19.8
N$21  (via drill 0.3)
  Top 0.256: K3.1 v16.9,19.8
  Bottom 0.254: D5.1 16.9,21.15 v16.9,19.8
  Bottom 0.256: v16.9,19.8 17.5,19.2 17.5,17.7 17.02,17.23 IC11.2
N$22
  Bottom 0.254: R5.1 R4.2 | R3.2 R5.1 | C4.1 R5.1
N$23  (via drill 0.3)
  Route14 0.152: v32.8,37 33.3,36.4 33.3,31.5 32.9,31.1 v32.4,31.1
  Bottom 0.152: v32.8,37 32.85,36.96 IC7.1 | IC7.8 32.33,31.94 32.33,31.2 v32.4,31.1
N$24
  Bottom 0.254: C30.2 IC7.6
N$25
  Bottom 0.61: Q2.1 33.9,26.82 C30.1 33.81,28.7 R14.2 R20.1
N$26
  Bottom 0.61: R19.1 R20.2 C27.2
N$27
  Top 0.305: IC6.3 4.9,33.9 5.2,33.9 5.4,33.7 C26.1
N$28  (via drill 0.3)
  Top 0.254: IC3.6 22.1,37.9 v24.3,37.9 | v26.3,39.2 26.32,39.23 IC3.13 | IC2.5 23.15,46.6 v23.1,47.3
  Route2 0.254: v26.3,39.2 26,39.2 25.8,39 25.8,38.3 25.4,37.9 v24.3,37.9 24,37.9 23.2,38.7 v23.25,44
  Route3 0.256: v23.25,44 23.25,47.1 v23.1,47.3
  Bottom 0.254: C20.2 22.09,47.8 22.7,47.8 23.1,47.4 v23.1,47.3
N$29  (via drill 0.3)
  Top 0.254: IC3.5 22.15,38.5 25.73,38.49 | 25.73,38.49 25.9,38.5 25.98,38.58 IC3.12 | IC2.3 27.55,45.3 v28.5,45.3 | v25.1,40.29 25.73,39.79 25.73,38.49
  Route2 0.254: v28.5,45.3 26.8,45.3 25.3,43.7 25.3,40.5 25.2,40.4 v25.1,40.29
  Bottom 0.254: C9.1 27.59,47.95 28,47.95 28.5,47.3 v28.5,45.3
N$30  (via drill 0.3)
  Top 0.254: v24.8,34 T1.2
  Bottom 0.254: R3.1 24.9,35 24.8,34.9 v24.8,34
N$31  (via drill 0.3)
  Top 0.254: IC3.11 27.9,37.9 v26.8,37.9 | v24.5,39.2 24.48,39.23 IC3.4
  Bottom 0.254: v24.5,39.2 24.5,38.6 25.2,37.9 v26.8,37.9 27.3,37.9 27.6,38.2 27.6,40.7 26.6,41.7 C17.2 R10.2
N$32  (via drill 0.3)
  Top 0.254: IC3.10 27.9,37.3 v26.2,37.3 | v25.2,39.3 24.62,39.88 | 24.62,39.88 IC3.3 | 24.62,39.88 24.5,39.95 24.5,42.65 24.6,42.7 v24.75,42.8
  Route14 0.254: v26.2,37.3 25.2,38.3 v25.2,39.3
  Bottom 0.254: C16.2 24.05,41.75 R11.2 24.55,43.1 v24.75,42.8
N$33  (via drill 0.3)  (1 unrouted)
  Top 0.254: IC2.1 v28.45,42.79
  Bottom 0.254: C1.1 28.69,42.8 v28.45,42.79 IC2.1 | R6.2 27.5,42.84
N$34  (via drill 0.3)
  Top 0.152: IC9.13 36.19,44.25 36.99,44.25 37.6,44.9 v37.59,44.97
  Bottom 0.254: v37.59,44.97 37.6,45.1 37.6,45.5 R31.1
N$35
  Bottom 0.305: R31.2 C45.1 C48.2
N$36  (via drill 0.3)
  Top 0.254: IC2.7 21.2,44.08 v21,44.1
  Bottom 0.254: C11.1 20.65,44.1 v21,44.1 R9.2
N$37
  Bottom 0.254: C18.- 24.05,45.55 24.05,45.25 R11.1
N$38  (via drill 0.3)
  Top 0.254: v24,47.4 24,46.1 23.2,45.3 22.12,45.3 IC2.6 22.05,45.3 21.73,45.3 21.26,45.31 v21,45.7
  Bottom 0.254: v24,47.4 C18.+ | v21,45.7 21,45.1 R9.1
N$39  (via drill 0.3)
  Top 0.254: v25.8,47.4 25.8,44.7 26.43,44.06 IC2.2 27.58,44 v28.45,44
  Bottom 0.254: C10.+ v25.8,47.4 | v28.45,44 28.4,43.9 R6.1
N$40
  Bottom 0.254: C10.- R10.1
N$41
  Bottom 0.305: C45.2 R32.1
N$43
  Bottom 0.305: R32.2 R33.2 C46.1
N$44  (via drill 0.3)
  Top 0.254: 35.05,46.42 IC9.18 35.05,46.74 v35.6,47.3 | IC9.4 33.55,41.05 33.7,40.9 v34.4,40.9 34.55,41 IC9.6
  Top 0.406: v40.43,45.55 40.63,45.4 R26.2 R24.1
  Route3 0.61: v40.43,45.55 39,46.6 38.3,46.6 37.6,47.3 v35.6,47.3 35.6,42.7 34.4,42 v34.4,40.9
  Bottom 0.254: FB4.1 32.6,47.3
  Bottom 0.406: 32.6,47.3 32.6,48 35.6,48 v35.6,47.3 35.6,47.5 C44.1 | C32.1 v34.4,40.9 R21.1
N$45
  Bottom 0.305: C46.2 45.8,45.5 46.1,45.2 46.1,39.2 45.44,38.53 IC10.3
N$46  (via drill 0.3)
  Route15 0.406: v44,40.6 44,39.5 44.9,38.6 v49.1,38.6
  Bottom 0.305: R28.1 44.01,41.76 C43.2
  Bottom 0.406: R28.1 44,41.7 v44,40.6 | v49.1,38.6 49.03,38.53 IC10.6
N$47
  Bottom 0.305: IC10.7 47.63,37.3 C51.2
N$48
  Bottom 0.406: IC10.5 48.7,39.8 49,40.1 C49.+
N$49  (via drill 0.3)
  Top 0.406: v45.6,35.8 45.65,35.75 J3.3
  Route14 0.406: C49.- 48.9,44.1 46.2,44.1 45.6,43.5 v45.6,35.8
N$50
  Top 0.157: C12.2 30.92,34.77 T1.4
N$51
  Top 0.157: C12.1 31.96,34.65 IC4.3
N$52
  Top 0.157: C13.2 26.16,30.05 IC4.1
N$53
  Top 0.406: C15.2 30.9,23.7 Q1.3
N$54
  Top 0.256: IC5.1 11.3,34.2 11.09,34.41 C19.1
  Top 0.406: C14.+ 8.31,34.41 9.3,34.41 | 9.3,34.41 C19.1 | FB2.1 9.7,31.4 9.3,31.8 9.3,34.41
N$55  (via drill 0.3)
  Top 0.254: 29.07,41.18 29.12,41.18 29.19,41.15 v29.19,40.81
  Top 0.406: C6.1 29.7,31 30,31.3 30,32.31 IC4.4 30.04,32.76 v29.6,33.3 | IC2.8 20.8,42.8 20.5,43.1 v20.5,43.4 | IC3.16 29.07,41.18
  Route3 0.406: v29.6,33.3 v29.6,36.2 28.7,37.2 28.7,40.3 v29.19,40.81 | 29.1,43.4 29.1,46 v29.4,46.3 | v20.5,43.4 29.1,43.4 | v29.19,40.81 29.16,40.84 | 29.1,43.4 29.1,41 29.19,40.91 v29.19,40.81
  Bottom 0.254: R4.1 29.4,36 29.6,36.1 v29.6,36.2
  Bottom 0.406: C5.1 v20.5,43.4 | v29.4,46.3 29.4,45.94 FB1.1 | C2.1 29.5,41.01 v29.19,40.81
N$56
  Bottom 0.2: IC8.3 20.2,30.1 19.8,29.7
  Bottom 0.254: 19.8,29.7 Y1.1
N$57
  Bottom 0.254: IC8.2 20.7,30.4 20.9,30.2 20.9,28.5 21.5,27.9 Y1.2
N$58
  Top 0.305: IC6.2 R13.1
N$59
  Bottom 0.254: C25.1 19.7,33.91 | 19.7,33.91 21.2,33.91 | 21.2,33.91 IC8.1 | IC8.7 19.7,33.91 | 21.2,33.91 C29.1
  Bottom 0.406: FB3.1 C29.1
N$60  (via drill 0.3)
  Top 0.152: IC9.19 34.6,46.4 34.6,47 34.9,47.3 v34.9,47.4
  Route2 0.152: v34.9,47.4 34.4,47.4 33.4,48.7 28.5,48.7 28.2,48.4 5,48.4 4.5,47.9 4.5,45.1 2.4,42.9 2.4,30.3 3.2,29.4 8,29.4 8.3,29.1 8.3,25.8 8.53,25.57 JP1.1
  Bottom 0.406: C40.2 9.1,23.63 JP1.1
N$61  (via drill 0.3)
  Top 0.152: IC9.22 33.1,46.4 33.1,47 33.3,47.2 v33.4,47.2
  Route2 0.152: v33.4,47.2 32.5,48.4 28.7,48.4 28.4,48.1 5.2,48.1 4.8,47.7 4.8,44.9 2.7,42.7 2.7,30.5 3.4,29.7 8.2,29.7 8.6,29.3 8.6,26.4 9.1,25.9 10.7,25.9 11.07,25.53 JP1.2
  Bottom 0.406: C39.2 11.2,24.07 JP1.2
N$62
  Bottom 0.158: IC12.6 47.95,23.75 47.95,18.09 47.14,17.48 44.5,17.48 42.67,17.48 42.27,17.07 42.27,14.83 42.27,13.01 41.9,12.63 IC13.5
N$63
  Bottom 0.158: IC12.4 49.99,23.81 49.99,22.96 49.58,22.55 48.56,22.55 48.36,22.35 48.36,17.88 47.35,17.07 44.5,17.07 43.08,17.07 42.67,16.66 42.67,14.83 42.67,12.39 42.27,11.99 40.44,11.99 40.03,12.39 40.03,13.41 40.52,13.9 IC13.6
N$64
  Bottom 0.254: IC13.8 41.16,16.4 40.4,16.4 39.6,17.2 Y3.1
N$65
  Bottom 0.254: Y3.3 39.8,14.8 40.17,15.18 IC13.7
N$67  (via drill 0.3)
  Top 0.158: USB.3 43.46,26.01 44.91,26.01 46.53,26.01 47.75,26.01 48.16,26.42 v48.16,27.43
  Bottom 0.158: v48.16,27.43 48.05,27.32 IC12.1
N$79  (via drill 0.3)
  Top 0.158: v49.99,27.43 49.78,27.64 49.12,27.64 48.56,27.13 48.56,26.21 47.95,25.6 45.11,25.6 44.71,25.2 USB.2
  Bottom 0.158: IC12.3 49.99,26.39 v49.99,27.43
PB0  (via drill 0.3)
  Top 0.152: v31.9,26.9 31.86,26.94
  Top 0.254: 31.86,26.94 Q1.1
  Route2 0.152: v30.47,33.34 31.3,32.4 31.3,27.2 31.6,26.9 v31.9,26.9
  Bottom 0.152: v30.47,33.34 30.7,33 IC7.10 IC7.9
PB2  (via drill 0.3)
  Top 0.152: v36.81,44.76 36.65,44.75 IC9.14
  Route14 0.152: v28.1,29.5 28.3,29.3 33.8,29.3 34.2,29.7 34.2,30.9 33.6,31.5 33.6,34.3 33.6,36.4 33.6,40 33.8,40.2 36.5,40.2 37.3,41 37.3,42.9 37.3,43.7 37.1,43.9 36.9,43.9 36.8,44 v36.81,44.76
  Bottom 0.254: R19.2 28.6,29.7 28.3,29.7 v28.1,29.5
PC2  (via drill 0.3)
  Top 0.152: R27.1 v38.5,47.7 40.2,47.7 40.5,47.4 R30.2 | IC9.25 31.4,45.7 30.9,45.7 30.8,45.8 v30.8,46.4
  Top 0.254: R30.2 C41.2
  Route14 0.152: v30.8,46.4 30.8,48 31.1,48.3 38.2,48.3 38.5,48.1 v38.5,47.7
PC3  (via drill 0.3)
  Top 0.152: IC9.26 30.28,45.25 30.1,45.1 29.8,44.8 29.8,44 v30.1,43.72
  Route2 0.152: ENCODER1.E 47,19.5 47,43.1 46.7,43.4 30.4,43.4 v30.1,43.72
  Route3 0.254: v35.3,35.8 36.1,34.8 42.9,34.8 44.9,32.8 44.9,19.6 45.5,19 ENCODER1.E
  Bottom 0.254: R23.1 R22.2 v35.3,35.8 | C36.2 ENCODER1.E
PTT  (via drill 0.3)
  Top 0.305: v49.6,33.9 49.45,34.05 J3.4
  Bottom 0.305: D3.1 49.2,34.5 v49.6,33.9
Q  (via drill 0.3)
  Top 0.254: IC9.24 32,46.4 v31.5,46.4
  Bottom 0.254: R1.1 31.5,45.2 31.3,45.4 31.2,45.4 | 31.2,45.4 30.5,45.4 29.7,44.7 29.7,44.1 29.51,43.81 C1.2 | v31.5,46.4 31.2,46 31.2,45.4
  Bottom 0.305: R2.2 R1.1
RF  (via drill 0.3)
  Top 0.139: 22.5,12 K3.5
  Top 0.406: v32.3,12.2 K2.5 v34.7,12.2 | v22.5,11.3 22.5,12 | K1.5 v13.7,12.2 | v22.5,13.1 K3.5 | C15.1 36.8,23.7 L1.1
  Route2 0.139: v32.3,12.2 31.1,11.2 v22.5,11.3 | v13.7,12.2 14.6,13 v22.5,13.1 | v34.7,12.2 arc90 35.4,13 35.4,18.3 35.4,22.8 arc-90 36.39,23.79 L1.1
  Bottom 0.61: Q2.3 L1.1
RF_RX
  Top 0.157: C13.1 D2.2
  Top 0.406: Q1.2 29.89,28.3 R12.2 27.15,28.3 D1.1 D2.2
RST  (via drill 0.3)
  Top 0.152: 31.4,43.7 IC9.29 30.85,43.75 v30.72,43.87
  Bottom 0.152: v30.72,43.87 30.99,43.6 36,43.6 36.3,43.3 36.3,42.7 36.3,42.4 36.3,42 36.4,41.9 R21.2
  Bottom 0.254: R21.2 37.1,41.8 J1.1
RX  (via drill 0.3)
  Top 0.152: IC9.30 30.98,43.25 30.86,43.14 29.95,43.14 v29.94,43.1
  Route2 0.152: v42.2,8.8 43.3,9.9 43.3,10.7 45.5,12.9 45.5,19.6 46.7,20.8 46.7,42.9 46.5,43.1 v29.94,43.1
  Bottom 0.152: IC13.2 41.23,8.8 v42.2,8.8
SCK
  Top 0.152: IC9.17 35.71,46.15 38.36,46.14 39.6,45.1 39.6,44.1 | 39.6,44.1 39.6,38.3 38.5,37.3 J1.4 | R24.2 39.6,44.1
  Bottom 0.305: J1.4 39,37.3 39.5,36.8 39.5,34.2 39.8,33.9 45.15,33.9 45.75,34.5 D3.2
SCL  (via drill 0.3)
  Top 0.152: 31.35,44.25 31.4,44.2 IC9.28 31.17,44.25 31.05,44.33 30.39,44.33 v30.3,44.41
  Route14 0.152: v30.3,44.41 30.2,44.5 21.7,44.5 21.4,44.8 20.9,44.8 20.5,44.4 12.1,44.4 9.9,44.4 9.2,43.7 9.2,38.2 9.2,31 v9.1,30.8 9.6,30.4 9.6,17.9 9.4,17.7 9.4,16.9 9.7,16.6 v10.3,16.6
  Bottom 0.152: Q4.3 v9.1,30.8 | v10.3,16.6 10.32,16.57 IC11.6
  Bottom 0.256: R18.1 Q4.3
SCL1  (via drill 0.3)
  Top 0.152: v31.3,41.7 31.35,41.65 IC9.1
  Route14 0.152: OLED.3 21.47,26.9 23.2,26.9 23.5,27.2 23.5,41.2 24,41.7 v31.3,41.7
  Bottom 0.254: OLED.3 20.2,25.63 R29.1
SCL_3V  (via drill 0.3)
  Top 0.254: v7.7,28.8 v7.7,26.7 v9.1,26.7
  Route2 0.152: v19.7,30.5 19.7,28.2 18.2,26.7 v9.1,26.7
  Bottom 0.152: IC8.4 v19.7,30.5
  Bottom 0.254: v7.7,26.7 7.4,26.4 R16.1 | Q4.2 v7.7,28.8
SDA  (via drill 0.3)
  Top 0.152: IC9.27 31.38,44.76 31.32,44.76 30.87,44.76 v30.82,44.79
  Route14 0.152: v30.82,44.79 30.7,44.98 30.1,45 29.9,44.8 21.9,44.8 21.6,45.1 20.7,45.1 20.3,44.7 12.1,44.7 9.6,44.7 8.9,44 8.9,38 8.9,32 v8.6,31.7 | v10.6,30.4 9.9,29.9 v9.9,17.2
  Bottom 0.152: v9.9,17.2 9.97,17.23 IC11.7 | v8.6,31.7 8.9,31.3 10.3,31.3 10.6,31 | 10.6,31 v10.6,30.4 | Q3.3 11.5,31 10.6,31
  Bottom 0.256: R17.1 11.6,32.3 Q3.3
SDA1  (via drill 0.3)
  Top 0.152: v30.1,42.3 30.5,42 30.8,42 31.1,42.25 31.2,42.25 IC9.32
  Route14 0.152: OLED.4 23.8,26.69 23.8,40.9 24.3,41.4 30.8,41.4 31,41.2 31.8,41.2 32,41.4 32,42.1 31.8,42.3 31.1,42.3 30.9,42.1 30.4,42.1 v30.1,42.3
  Bottom 0.254: OLED.4 R25.1
SDA_3V  (via drill 0.3)
  Top 0.254: v11.5,26.2 v11.5,28.9
  Route2 0.152: v18.9,30.5 19.4,29.9 19.4,28.4 18,27 11.7,27 11.5,27.2
  Route2 0.155: 11.5,27.2 v11.5,28.9
  Bottom 0.152: IC8.5 19.2,30.8 v18.9,30.5
  Bottom 0.254: v11.5,28.9 Q3.2 | R15.1 10.8,26.3 v11.5,26.2
TX  (via drill 0.3)
  Top 0.152: IC9.31 30.8,42.76 v30.7,42.6
  Route2 0.152: v42.2,10.1 45.2,13.1 45.2,19.6 44.7,20.2 44.7,28.2 45.2,28.7 46.4,29.9 46.4,42.5 46.1,42.8 30.9,42.8 v30.7,42.6
  Bottom 0.152: IC13.3 v42.2,10.1
V3
  Bottom 0.406: C73.2 40.1,10.04 40.1,11 40.47,11.37 IC13.4
VBUS  (via drill 0.3)
  Top 0.406: USB.1 43.47,24.38 44.7,24.38 45.31,24.99 v48.97,24.99
  Route15 0.406: v48.56,8.23 47.95,8.84 47.95,17.07 47.95,24.18 48.77,24.99 v48.97,24.99
  Bottom 0.254: IC13.16 46.85,7.5
  Bottom 0.406: 46.85,7.5 C71.2 48.56,7.53 v48.56,8.23 | IC12.5 49,24.76 v48.97,24.99 46.04,24.99 C72.1
VDD  (via drill 0.3)
  Top 0.406: v17.4,35.7 17.36,35.64 C8.1 IC1.2
  Route3 0.406: v12.5,27.9 12.5,36.7 13,37.1 v17.4,37.1
  Route15 0.406: v25.1,37.1 v17.4,37.1 v17.4,35.7
  Bottom 0.255: R16.2 8.7,27.4 | 8.7,27.4 R15.2 12,27.4 v12.5,27.9 12.5,28.85 Q3.1 | Q4.1 8.7,28.75 8.7,27.4
  Bottom 0.406: FB3.2 22.46,37.1 v25.1,37.1
VIN  (via drill 0.3)
  Top 0.254: v15.3,33.5 15.15,33.65 IC5.8 C21.1
  Top 0.305: IC6.1 3.55,33.8 v3.55,33.2
  Top 0.406: C21.1 v11.9,34.5
  Route15 0.406: v11.9,34.5 10.9,33.3 3.7,33.3 v3.55,33.2
  Route15 0.813: L1.2 36.31,32.29 21.5,32.29 20.3,33.5 v15.3,33.5
  Bottom 0.305: 3.54,32.47 C24.1
  Bottom 0.406: R23.2 36.99,34.79 C22.1 | v3.55,33.2 3.54,32.47
  Bottom 0.61: C22.1 L1.2
  Bottom 0.813: C23.+ L1.2
VIN1  (via drill 0.3, 0.4)
  Top 0.254: ON/OF.2 3.4,40.3 v4.5,40.3
  Top 0.305: v3.8,37 3.55,36.55 IC6.6
  Top 0.813: J2.VIN0 v16.6,46.4
  Route15 0.254: v4.5,40.3 3.8,40.3 3.8,41.4
  Route15 0.813: v16.6,46.4 14.2,43.8 6.2,43.8 4.2,41.8 3.8,41.4 3.8,40.3 v3.8,37
  Bottom 0.406: C35.1 5.48,37 v3.8,37

## Text on the board
tNames: ON/OFF | ISP | SWR | RF | uSDX | 80M | 20M | 40M
bNames: 2024-01-02